# Altium schematic sheet FPGA.SchDoc: FPGA
size 420 x 297 mm; Author: G.K.; CompanyName: WUT; DrawnBy: G.K.; Organization: CERN; Address1: Warsaw Univeristy of Technology; Address2: Nowowiejska 15/19; DocumentNumber: 2; Revision: -; SheetNumber: 2; SheetTotal: 9; EDA_Number: ARTIQ; Projet: Banker; ModifiedBy: -; CreateDate: XX/XX/XXXX; CheckedDate: -; Title2: LVCMOS banks; DivGrp: ISE; Designer: G.K.; ModifiedDate: -; ProjectName: ADC/DAC MEZZANINE
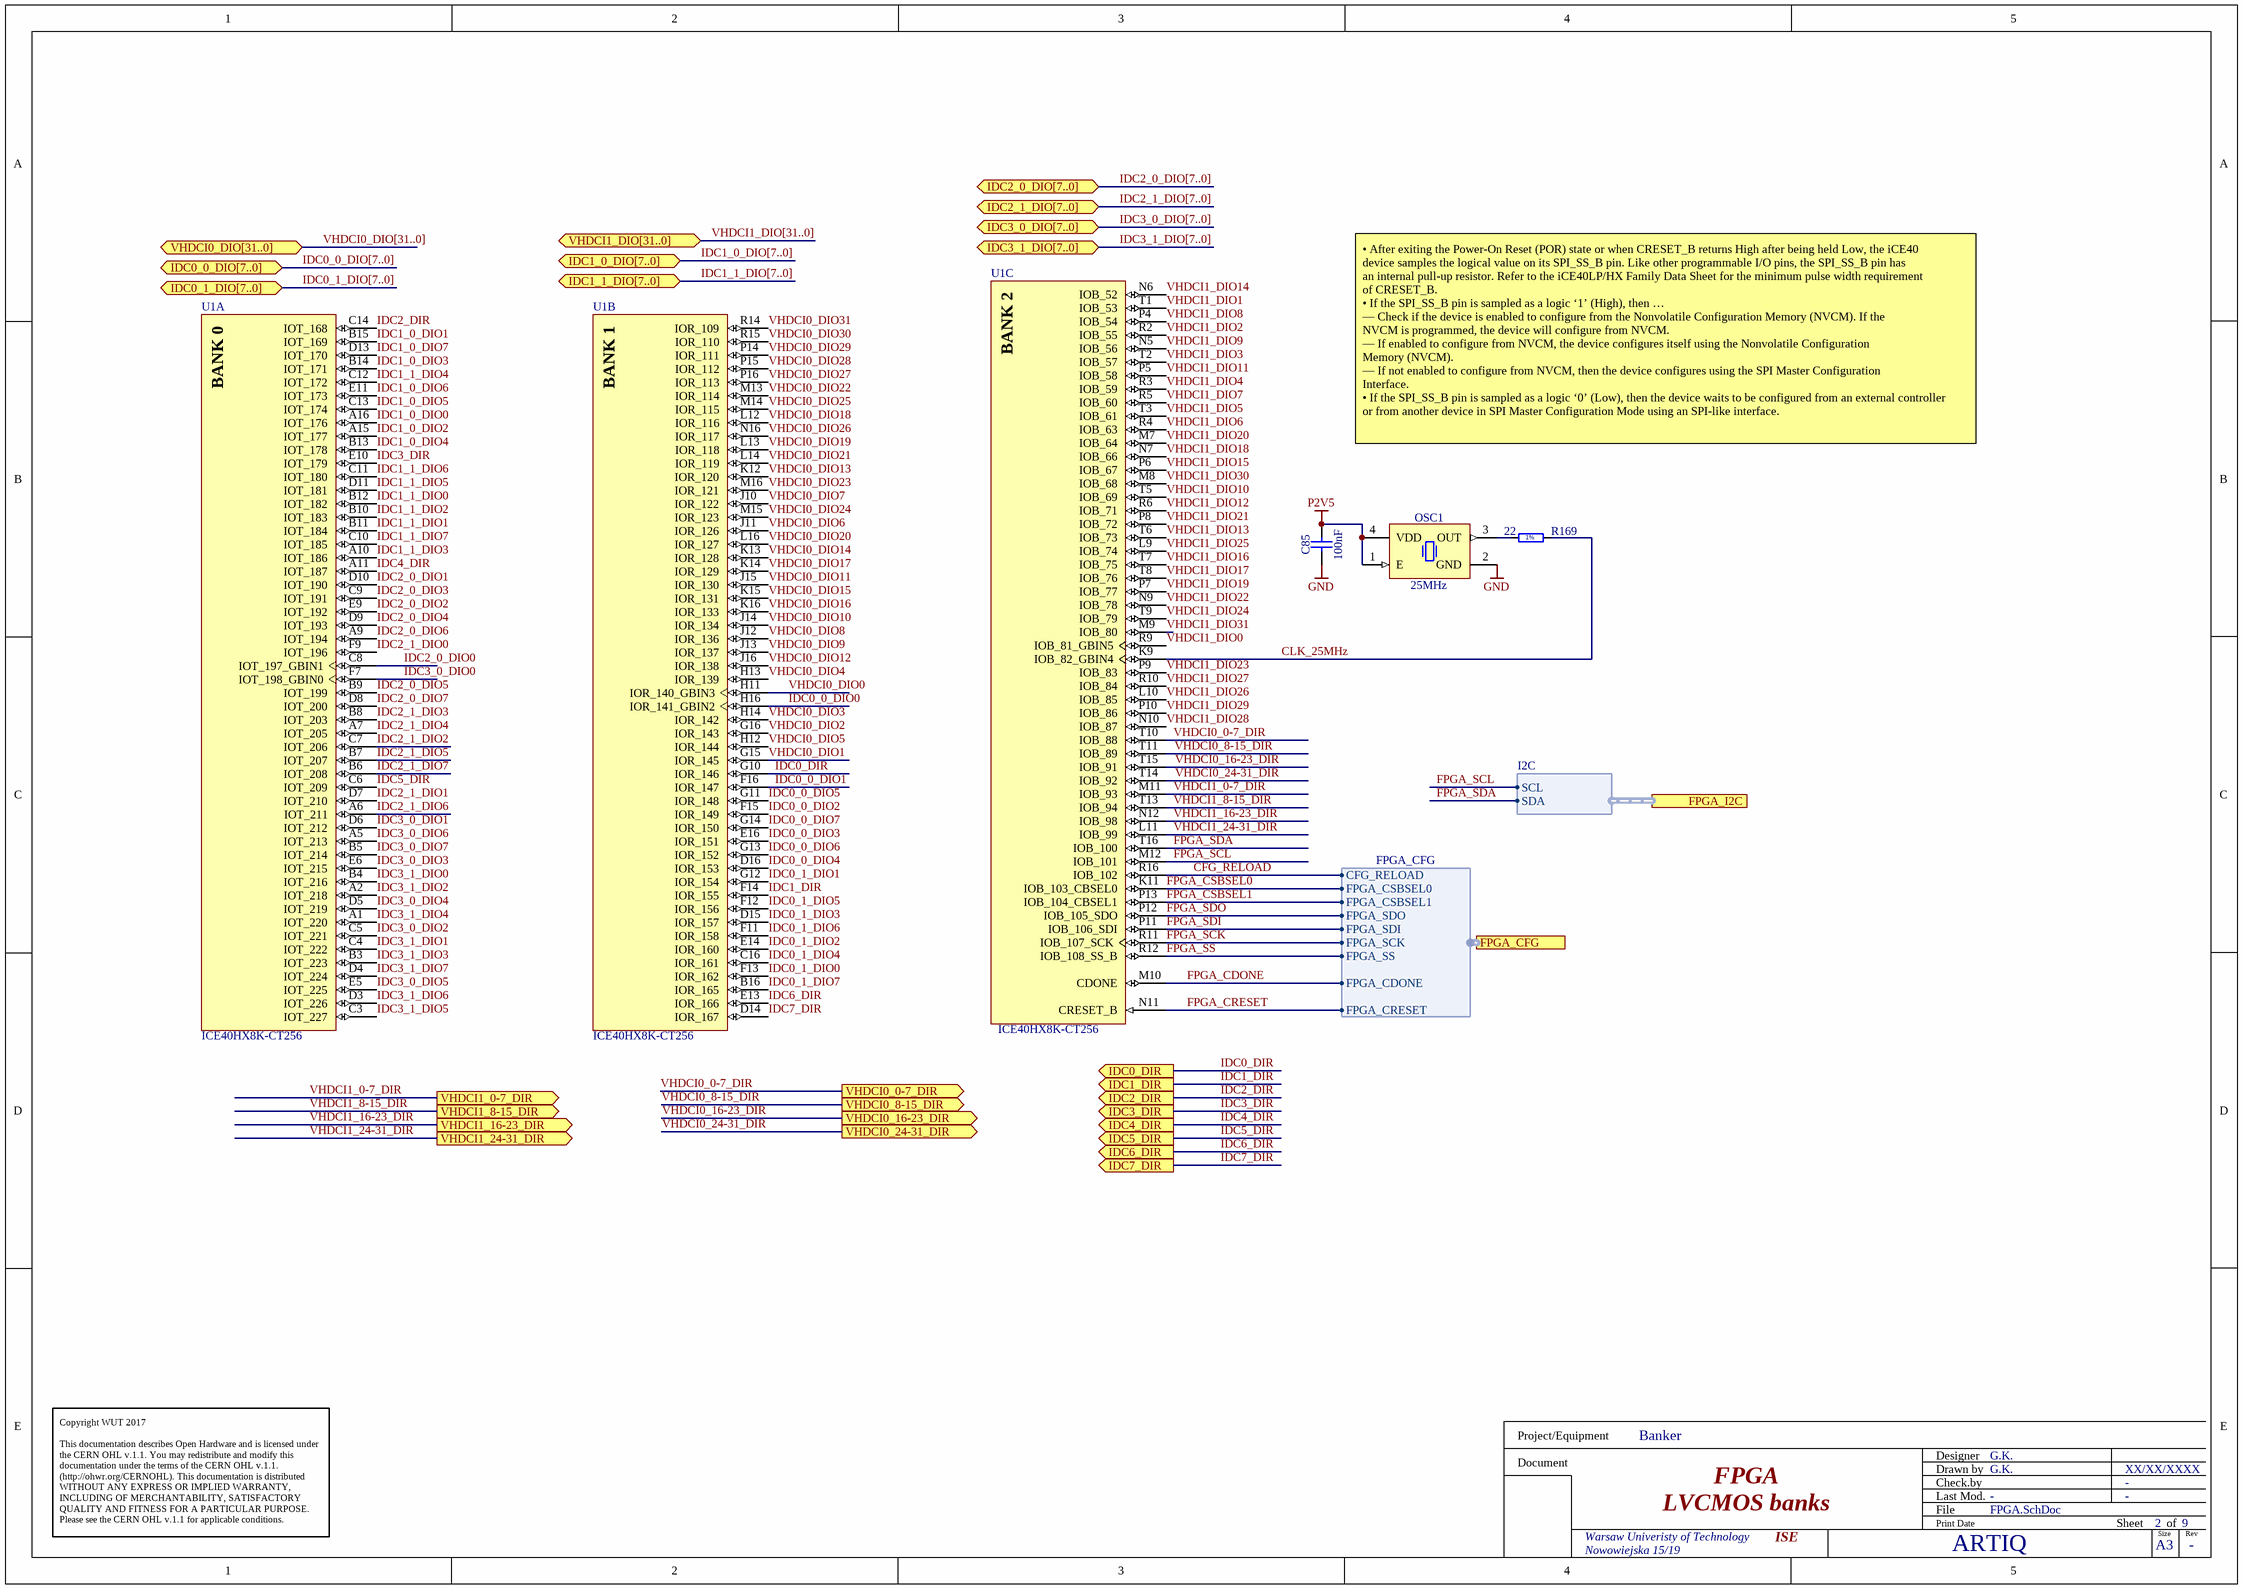
[diagram p0: FPGA.SchDoc]

## Parts
C85  100nF  [CAPC1005X55N]
OSC1  25MHz  [OSC_ECS_ECS-3525]
R169  22  [RESC1005X40N]
U1  ICE40HX8K-CT256  [LATC-caBGA-256]  (parts A,B,C of 5)

## Ports
FPGA_CFG (harness FPGA_CFG), FPGA_I2C (harness I2C), IDC0_0_DIO[7..0] (bidir), IDC0_1_DIO[7..0] (bidir), IDC0_DIR (out), IDC1_0_DIO[7..0] (bidir), IDC1_1_DIO[7..0] (bidir), IDC1_DIR (out), IDC2_0_DIO[7..0] (bidir), IDC2_1_DIO[7..0] (bidir), IDC2_DIR (out), IDC3_0_DIO[7..0] (bidir), IDC3_1_DIO[7..0] (bidir), IDC3_DIR (out), IDC4_DIR (out), IDC5_DIR (out), IDC6_DIR (out), IDC7_DIR (out), VHDCI0_0-7_DIR (out), VHDCI0_8-15_DIR (out), VHDCI0_16-23_DIR (out), VHDCI0_24-31_DIR (out), VHDCI0_DIO[31..0] (bidir), VHDCI1_0-7_DIR (out), VHDCI1_8-15_DIR (out), VHDCI1_16-23_DIR (out), VHDCI1_24-31_DIR (out), VHDCI1_DIO[31..0] (bidir)

## Harnesses
I2C: SDA, SCL
FPGA_CFG: FPGA_CSBSEL0, FPGA_CSBSEL1, FPGA_SDO, FPGA_SDI, FPGA_SCK, FPGA_SS, FPGA_CDONE, FPGA_CRESET, CFG_RELOAD

## Nets
GND: C85.1 OSC1.2(GND)
P2V5: C85.2 OSC1.1(E) OSC1.4(VDD)
CFG_RELOAD: U1.R16(IOB_102) ; port FPGA_CFG.CFG_RELOAD
CLK_25MHz: R169.2 U1.K9(IOB_82_GBIN4)
FPGA_CDONE: U1.M10(CDONE) ; port FPGA_CFG.FPGA_CDONE
FPGA_CRESET: U1.N11(CRESET_B) ; port FPGA_CFG.FPGA_CRESET
FPGA_CSBSEL0: U1.K11(IOB_103_CBSEL0) ; port FPGA_CFG.FPGA_CSBSEL0
FPGA_CSBSEL1: U1.P13(IOB_104_CBSEL1) ; port FPGA_CFG.FPGA_CSBSEL1
FPGA_SCK: U1.R11(IOB_107_SCK) ; port FPGA_CFG.FPGA_SCK
FPGA_SCL: U1.M12(IOB_101) ; port FPGA_I2C.SCL
FPGA_SDA: U1.T16(IOB_100) ; port FPGA_I2C.SDA
FPGA_SDI: U1.P11(IOB_106_SDI) ; port FPGA_CFG.FPGA_SDI
FPGA_SDO: U1.P12(IOB_105_SDO) ; port FPGA_CFG.FPGA_SDO
FPGA_SS: U1.R12(IOB_108_SS_B) ; port FPGA_CFG.FPGA_SS
IDC0_0_DIO0: U1.H16(IOR_141_GBIN2)
IDC0_0_DIO1: U1.F16(IOR_147)
IDC0_0_DIO2: U1.F15(IOR_149)
IDC0_0_DIO3: U1.E16(IOR_151)
IDC0_0_DIO4: U1.D16(IOR_153)
IDC0_0_DIO5: U1.G11(IOR_148)
IDC0_0_DIO6: U1.G13(IOR_152)
IDC0_0_DIO7: U1.G14(IOR_150)
IDC0_1_DIO0: U1.F13(IOR_162)
IDC0_1_DIO1: U1.G12(IOR_154)
IDC0_1_DIO2: U1.E14(IOR_160)
IDC0_1_DIO3: U1.D15(IOR_157)
IDC0_1_DIO4: U1.C16(IOR_161)
IDC0_1_DIO5: U1.F12(IOR_156)
IDC0_1_DIO6: U1.F11(IOR_158)
IDC0_1_DIO7: U1.B16(IOR_165)
IDC0_DIR: U1.G10(IOR_146) ; port IDC0_DIR
IDC1_0_DIO0: U1.A16(IOT_176)
IDC1_0_DIO1: U1.B15(IOT_169)
IDC1_0_DIO2: U1.A15(IOT_177)
IDC1_0_DIO3: U1.B14(IOT_171)
IDC1_0_DIO4: U1.B13(IOT_178)
IDC1_0_DIO5: U1.C13(IOT_174)
IDC1_0_DIO6: U1.E11(IOT_173)
IDC1_0_DIO7: U1.D13(IOT_170)
IDC1_1_DIO0: U1.B12(IOT_182)
IDC1_1_DIO1: U1.B11(IOT_184)
IDC1_1_DIO2: U1.B10(IOT_183)
IDC1_1_DIO3: U1.A10(IOT_186)
IDC1_1_DIO4: U1.C12(IOT_172)
IDC1_1_DIO5: U1.D11(IOT_181)
IDC1_1_DIO6: U1.C11(IOT_180)
IDC1_1_DIO7: U1.C10(IOT_185)
IDC1_DIR: U1.F14(IOR_155) ; port IDC1_DIR
IDC2_0_DIO0: U1.C8(IOT_197_GBIN1)
IDC2_0_DIO1: U1.D10(IOT_190)
IDC2_0_DIO2: U1.E9(IOT_192)
IDC2_0_DIO3: U1.C9(IOT_191)
IDC2_0_DIO4: U1.D9(IOT_193)
IDC2_0_DIO5: U1.B9(IOT_199)
IDC2_0_DIO6: U1.A9(IOT_194)
IDC2_0_DIO7: U1.D8(IOT_200)
IDC2_1_DIO0: U1.F9(IOT_196)
IDC2_1_DIO1: U1.D7(IOT_210)
IDC2_1_DIO2: U1.C7(IOT_206)
IDC2_1_DIO3: U1.B8(IOT_203)
IDC2_1_DIO4: U1.A7(IOT_205)
IDC2_1_DIO5: U1.B7(IOT_207)
IDC2_1_DIO6: U1.A6(IOT_211)
IDC2_1_DIO7: U1.B6(IOT_208)
IDC2_DIR: U1.C14(IOT_168) ; port IDC2_DIR
IDC3_0_DIO0: U1.F7(IOT_198_GBIN0)
IDC3_0_DIO1: U1.D6(IOT_212)
IDC3_0_DIO2: U1.C5(IOT_221)
IDC3_0_DIO3: U1.E6(IOT_215)
IDC3_0_DIO4: U1.D5(IOT_219)
IDC3_0_DIO5: U1.E5(IOT_225)
IDC3_0_DIO6: U1.A5(IOT_213)
IDC3_0_DIO7: U1.B5(IOT_214)
IDC3_1_DIO0: U1.B4(IOT_216)
IDC3_1_DIO1: U1.C4(IOT_222)
IDC3_1_DIO2: U1.A2(IOT_218)
IDC3_1_DIO3: U1.B3(IOT_223)
IDC3_1_DIO4: U1.A1(IOT_220)
IDC3_1_DIO5: U1.C3(IOT_227)
IDC3_1_DIO6: U1.D3(IOT_226)
IDC3_1_DIO7: U1.D4(IOT_224)
IDC3_DIR: U1.E10(IOT_179) ; port IDC3_DIR
IDC4_DIR: U1.A11(IOT_187) ; port IDC4_DIR
IDC5_DIR: U1.C6(IOT_209) ; port IDC5_DIR
IDC6_DIR: U1.E13(IOR_166) ; port IDC6_DIR
IDC7_DIR: U1.D14(IOR_167) ; port IDC7_DIR
VHDCI0_0-7_DIR: U1.T10(IOB_88) ; port VHDCI0_0-7_DIR
VHDCI0_8-15_DIR: U1.T11(IOB_89) ; port VHDCI0_8-15_DIR
VHDCI0_16-23_DIR: U1.T15(IOB_91) ; port VHDCI0_16-23_DIR
VHDCI0_24-31_DIR: U1.T14(IOB_92) ; port VHDCI0_24-31_DIR
VHDCI0_DIO0: U1.H11(IOR_140_GBIN3)
VHDCI0_DIO1: U1.G15(IOR_145)
VHDCI0_DIO2: U1.G16(IOR_143)
VHDCI0_DIO3: U1.H14(IOR_142)
VHDCI0_DIO4: U1.H13(IOR_139)
VHDCI0_DIO5: U1.H12(IOR_144)
VHDCI0_DIO6: U1.J11(IOR_126)
VHDCI0_DIO7: U1.J10(IOR_122)
VHDCI0_DIO8: U1.J12(IOR_136)
VHDCI0_DIO9: U1.J13(IOR_137)
VHDCI0_DIO10: U1.J14(IOR_134)
VHDCI0_DIO11: U1.J15(IOR_130)
VHDCI0_DIO12: U1.J16(IOR_138)
VHDCI0_DIO13: U1.K12(IOR_120)
VHDCI0_DIO14: U1.K13(IOR_128)
VHDCI0_DIO15: U1.K15(IOR_131)
VHDCI0_DIO16: U1.K16(IOR_133)
VHDCI0_DIO17: U1.K14(IOR_129)
VHDCI0_DIO18: U1.L12(IOR_116)
VHDCI0_DIO19: U1.L13(IOR_118)
VHDCI0_DIO20: U1.L16(IOR_127)
VHDCI0_DIO21: U1.L14(IOR_119)
VHDCI0_DIO22: U1.M13(IOR_114)
VHDCI0_DIO23: U1.M16(IOR_121)
VHDCI0_DIO24: U1.M15(IOR_123)
VHDCI0_DIO25: U1.M14(IOR_115)
VHDCI0_DIO26: U1.N16(IOR_117)
VHDCI0_DIO27: U1.P16(IOR_113)
VHDCI0_DIO28: U1.P15(IOR_112)
VHDCI0_DIO29: U1.P14(IOR_111)
VHDCI0_DIO30: U1.R15(IOR_110)
VHDCI0_DIO31: U1.R14(IOR_109)
VHDCI1_0-7_DIR: U1.M11(IOB_93) ; port VHDCI1_0-7_DIR
VHDCI1_8-15_DIR: U1.T13(IOB_94) ; port VHDCI1_8-15_DIR
VHDCI1_16-23_DIR: U1.N12(IOB_98) ; port VHDCI1_16-23_DIR
VHDCI1_24-31_DIR: U1.L11(IOB_99) ; port VHDCI1_24-31_DIR
VHDCI1_DIO0: U1.R9(IOB_81_GBIN5)
VHDCI1_DIO1: U1.T1(IOB_53)
VHDCI1_DIO2: U1.R2(IOB_55)
VHDCI1_DIO3: U1.T2(IOB_57)
VHDCI1_DIO4: U1.R3(IOB_59)
VHDCI1_DIO5: U1.T3(IOB_61)
VHDCI1_DIO6: U1.R4(IOB_63)
VHDCI1_DIO7: U1.R5(IOB_60)
VHDCI1_DIO8: U1.P4(IOB_54)
VHDCI1_DIO9: U1.N5(IOB_56)
VHDCI1_DIO10: U1.T5(IOB_69)
VHDCI1_DIO11: U1.P5(IOB_58)
VHDCI1_DIO12: U1.R6(IOB_71)
VHDCI1_DIO13: U1.T6(IOB_73)
VHDCI1_DIO14: U1.N6(IOB_52)
VHDCI1_DIO15: U1.P6(IOB_67)
VHDCI1_DIO16: U1.T7(IOB_75)
VHDCI1_DIO17: U1.T8(IOB_76)
VHDCI1_DIO18: U1.N7(IOB_66)
VHDCI1_DIO19: U1.P7(IOB_77)
VHDCI1_DIO20: U1.M7(IOB_64)
VHDCI1_DIO21: U1.P8(IOB_72)
VHDCI1_DIO22: U1.N9(IOB_78)
VHDCI1_DIO23: U1.P9(IOB_83)
VHDCI1_DIO24: U1.T9(IOB_79)
VHDCI1_DIO25: U1.L9(IOB_74)
VHDCI1_DIO26: U1.L10(IOB_85)
VHDCI1_DIO27: U1.R10(IOB_84)
VHDCI1_DIO28: U1.N10(IOB_87)
VHDCI1_DIO29: U1.P10(IOB_86)
VHDCI1_DIO30: U1.M8(IOB_68)
VHDCI1_DIO31: U1.M9(IOB_80)
NetOSC1_3: OSC1.3(OUT) R169.1

## Buses and harness runs
bus IDC0_0_DIO[7..0] = port IDC0_0_DIO[7..0]
bus IDC0_1_DIO[7..0] = port IDC0_1_DIO[7..0]
bus IDC1_0_DIO[7..0] = port IDC1_0_DIO[7..0]
bus IDC1_1_DIO[7..0] = port IDC1_1_DIO[7..0]
bus IDC2_0_DIO[7..0] = port IDC2_0_DIO[7..0]
bus IDC2_1_DIO[7..0] = port IDC2_1_DIO[7..0]
bus IDC3_0_DIO[7..0] = port IDC3_0_DIO[7..0]
bus IDC3_1_DIO[7..0] = port IDC3_1_DIO[7..0]
bus VHDCI0_DIO[31..0] = port VHDCI0_DIO[31..0]
bus VHDCI1_DIO[31..0] = port VHDCI1_DIO[31..0]

## Notes on the sheet
- • After exiting the Power-On Reset (POR) state or when CRESET_B returns High after being held Low, the iCE40
  device samples the logical value on its SPI_SS_B pin. Like other programmable I/O pins, the SPI_SS_B pin has
  an internal pull-up resistor. Refer to the iCE40LP/HX Family Data Sheet for the minimum pulse width requirement
  of CRESET_B.
  • If the SPI_SS_B pin is sampled as a logic ‘1’ (High), then …
  — Check if the device is enabled to configure from the Nonvolatile Configuration Memory (NVCM). If the
  NVCM is programmed, the device will configure from NVCM.
  — If enabled to configure from NVCM, the device configures itself using the Nonvolatile Configuration
  Memory (NVCM).
  — If not enabled to configure from NVCM, then the device configures using the SPI Master Configuration
  Interface.
  • If the SPI_SS_B pin is sampled as a logic ‘0’ (Low), then the device waits to be configured from an external controller
  or from another device in SPI Master Configuration Mode using an SPI-like interface.
- Copyright WUT 2017
  This documentation describes Open Hardware and is licensed under the CERN OHL v.1.1. You may redistribute and modify this documentation under the terms of the CERN OHL v.1.1. (http://ohwr.org/CERNOHL). This documentation is distributed WITHOUT ANY EXPRESS OR IMPLIED WARRANTY, INCLUDING OF MERCHANTABILITY, SATISFACTORY QUALITY AND FITNESS FOR A PARTICULAR PURPOSE. Please see the CERN OHL v.1.1 for applicable conditions.
- Project/Equipment
- Document
- Designer
- Drawn by
- Check.by
- File
- Last Mod.
- Print Date
- Sheet
- Size
- A3
- of
- Rev
- (in symbol CMP-0962-00001-1, part A) BANK 0
- (in symbol CMP-0962-00001-1, part B) BANK 1
- (in symbol CMP-0962-00001-1, part C) BANK 2
- (in symbol R0402_22R_1%_0.0625W_100PPM) 1%

## Library data of the parts
C85 = CC0402_100NF_16V_10%_X5R: Non-polarised capacitor; Part Description: SMD Multilayer Chip Ceramic Capacitor; Manufacturer: GENERIC; Manufacturer1 Part Number: GRM155R61C104KA88D; Voltage: 16V; TC: X5R; Tolerance: ±10%; Part Number: CC0402_100NF_16V_10%_X5R; Component Kind: Standard; Component Type: Standard; Pin Count: 2; Value: 100nF; Status: None; Manufacturer Part Number: CC0402_100NF_16V_10%_X5R; Case: 0402; Mounted: Yes; Socket: No; SMD: Yes; Sense: No; Manufacturer1 Example: MURATA; Manufacturer1 ComponentHeight: 0.55mm; HelpURL: \\cern.ch\dfs\Applications\Altium\Datasheets\CC0402_X5R_MURATA_GRM.pdf; Author: CERN DEM JLC; CreateDate: 10.12.2013; LatestRevisionDate: 10.12.2013
OSC1 = OSC_25MHZ_ECS_ECS-3525-250-B: Oscillator 4 pins 1=E/D 2=GND 3=OUT 4=VDD; Part Description: 2.5V, ±50ppm, 15pF, -0 to 70°C, Surface Mount Clock Oscillator (ECS-3518/3525 Series); Manufacturer: ECS; PressFit: No; Bonding: No; Part Number: OSC_25MHZ_ECS_ECS-3525-250-B; Component Kind: Standard; Component Type: Standard; PackageDescription: SMD Oscillator, 4 pins, 5 x 3.2mm, ECS-3525 Series; Value: 25MHz; Manufacturer Part Number: ECS-3525-250-B; Pin Count: 4; Mounted: Yes; Socket: No; SMD: Yes; Sense: No; ComponentHeight: 1.3mm; HelpURL: \\cern.ch\dfs\Applications\Altium\Datasheets\OSC_ECS_ECS-3525.pdf; Author: CERN DEM JLC; CreateDate: 14/08/2017; LatestRevisionDate: 14/08/2017
R169 = R0402_22R_1%_0.0625W_100PPM: Resistor - 1%; Part Description: General Purpose Thick Film Chip Resistor; Manufacturer: GENERIC; Manufacturer1 Part Number: 232270672209L; TC: ±100ppm/°C; PressFit: No; Part Number: R0402_22R_1%_0.0625W_100PPM; Component Kind: Standard; Component Type: Standard; Pin Count: 2; Value: 22; Status: Not Recommended; Power: 0.0625W; Tolerance: ±1%; Manufacturer Part Number: R0402_22R_1%_0.0625W_100PPM; Case: 0402; Mounted: Yes; Sense: No; Socket: No; SMD: Yes; Manufacturer1 Example: YAGEO PHYCOMP; Manufacturer1 ComponentHeight: 0.4mm; HelpURL: \\cern.ch\dfs\Applications\Altium\Datasheets\R0402_Phycomp_RC0402.pdf; Author: CERN DEM JLC; CreateDate: 03/12/2007; LatestRevisionDate: 17/10/2012
U1 = CMP-0962-00001-1: iCE40 HX8K Series FPGA Family, 7680 Logic Cells, 1.2 V Core, 128 K Embedded RAM Bits, 256-ball caBGA, Pb-Free, Tray; Manufacturer: Lattice Semiconductor; Supply Voltage: 1.2V; Phase-Locked Loops: 2; Logic Cells: 7680; Embedded RAM Bits: 128K; PackageReference: caBGA-256; PackageDescription: 256-Ball Chip Array Ball Grid Array, Body 14 x 14 mm, Pitch 0.8 mm; RoHS: TRUE; Packing: Tray; Mounting Technology: Surface Mount; ComponentLink3URL: http://www.latticesemi.com/lit/docs/package/pkg.pdf; ComponentLink1Description: Manufacturer URL; ComponentLink3Description: Package Specification; Code_JEDEC: MO-275; PackageVersion: Rev. 03.9, 02/2013; ComponentLink1URL: http://www.latticesemi.com/en; ComponentLink2URL: http://www.latticesemi.com/~/media/Documents/DataSheets/iCE/iCE40LPHXFamilyDataSheet.pdf; PartNumber: ICE40HX8K-CT256; ComponentLink2Description: Datasheet; DatasheetVersion: Rev. 02.9